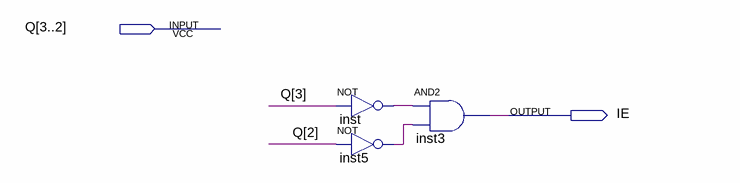
[diagram p0: schematic sheet]
// Quartus schematic IE.bdf as structural Verilog: 3 symbols, 2 pins
module IE (
  input  [3:2] Q,
  output IE
);

  wire inst5_out, inst_out;

  not inst (inst_out, Q[3]);
  not inst5 (inst5_out, Q[2]);
  and inst3 (IE, inst_out, inst5_out);
endmodule
